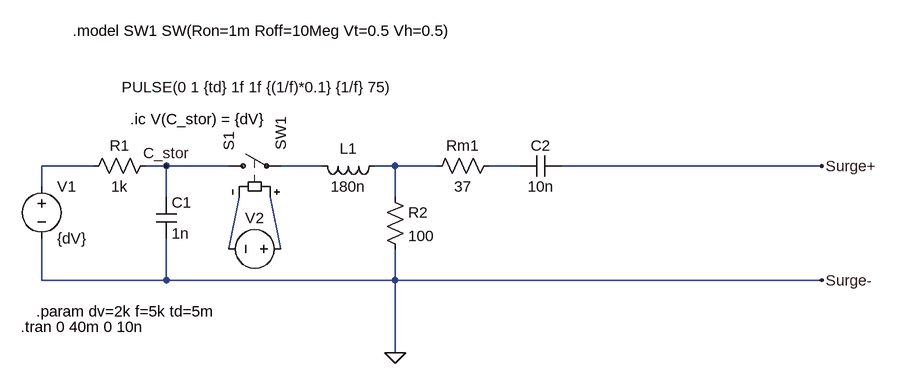
[diagram p0: schematic burst-eft-test.asc]
burst-eft-test.asc, the LTspice schematic file:
Version 4
SHEET 1 2304 1252
WIRE 80 96 0 96
WIRE 192 96 160 96
WIRE 288 96 192 96
WIRE 432 96 368 96
WIRE 544 96 512 96
WIRE 608 96 544 96
WIRE 736 96 688 96
WIRE 1200 96 800 96
WIRE 0 128 0 96
WIRE 192 144 192 96
WIRE 544 144 544 96
WIRE 288 224 304 144
WIRE 368 224 352 144
WIRE 0 272 0 208
WIRE 192 272 192 208
WIRE 192 272 0 272
WIRE 544 272 544 224
WIRE 544 272 192 272
WIRE 1200 272 544 272
WIRE 544 384 544 272
FLAG 192 96 C_stor
FLAG 1200 96 Surge+
FLAG 1200 272 Surge-
FLAG 544 384 0
SYMBOL voltage 0 112 R0
WINDOW 123 0 0 Left 0
WINDOW 39 0 0 Left 0
SYMATTR InstName V1
SYMATTR Value {dV}
SYMBOL res 176 80 R90
WINDOW 0 0 56 VBottom 2
WINDOW 3 32 56 VTop 2
SYMATTR InstName R1
SYMATTR Value 1k
SYMBOL cap 176 144 R0
SYMATTR InstName C1
SYMATTR Value 1n
SYMBOL sw 272 96 R270
SYMATTR InstName S1
SYMATTR Value SW1
SYMBOL ind 528 80 R90
WINDOW 0 5 56 VBottom 2
WINDOW 3 32 56 VTop 2
SYMATTR InstName L1
SYMATTR Value 180n
SYMBOL res 528 128 R0
SYMATTR InstName R2
SYMATTR Value 100
SYMBOL res 704 80 R90
WINDOW 0 0 56 VBottom 2
WINDOW 3 32 56 VTop 2
SYMATTR InstName Rm1
SYMATTR Value 37
SYMBOL cap 800 80 R90
WINDOW 0 0 32 VBottom 2
WINDOW 3 32 32 VTop 2
SYMATTR InstName C2
SYMATTR Value 10n
SYMBOL voltage 384 224 R90
WINDOW 0 -32 56 VBottom 2
WINDOW 3 -265 51 VTop 2
WINDOW 123 0 0 Left 0
WINDOW 39 0 0 Left 0
SYMATTR InstName V2
SYMATTR Value PULSE(0 1 {td} 1f 1f {(1/f)*0.1} {1/f} 75)
TEXT -8 320 Left 2 !.param dv=2k f=5k td=5m
TEXT 48 -112 Left 2 !.model SW1 SW(Ron=1m Roff=10Meg Vt=0.5 Vh=0.5)
TEXT 136 24 Left 2 !.ic V(C_stor) = {dV}
TEXT -32 344 Left 2 !.tran 0 40m 0 10n

The netlist it stands for:
* burst-eft-test.asc
V1 N001 0 {dV}
R1 C_stor N001 1k
C1 C_stor 0 1n
S1 C_stor N002 N006 N005 SW1
L1 N003 N002 180n
R2 N003 0 100
Rm1 N004 N003 37
C2 Surge+ N004 10n
V2 N006 N005 PULSE(0 1 {td} 1f 1f {(1/f)*0.1} {1/f} 75)
.param dv=2k f=5k td=5m
.model SW1 SW(Ron=1m Roff=10Meg Vt=0.5 Vh=0.5)
.ic V(C_stor) = {dV}
.tran 0 40m 0 10n
.backanno
.end